# Altium schematic sheet NMT_VGA.SCHDOC
size A4; Organization: Altium Limited; Address1: L3, 12a Rodborough Rd; Address2: Frenchs Forest; Address3: NSW; Address4: Australia 2086; DocumentNumber: 4; SheetNumber: 10; SheetTotal: 13
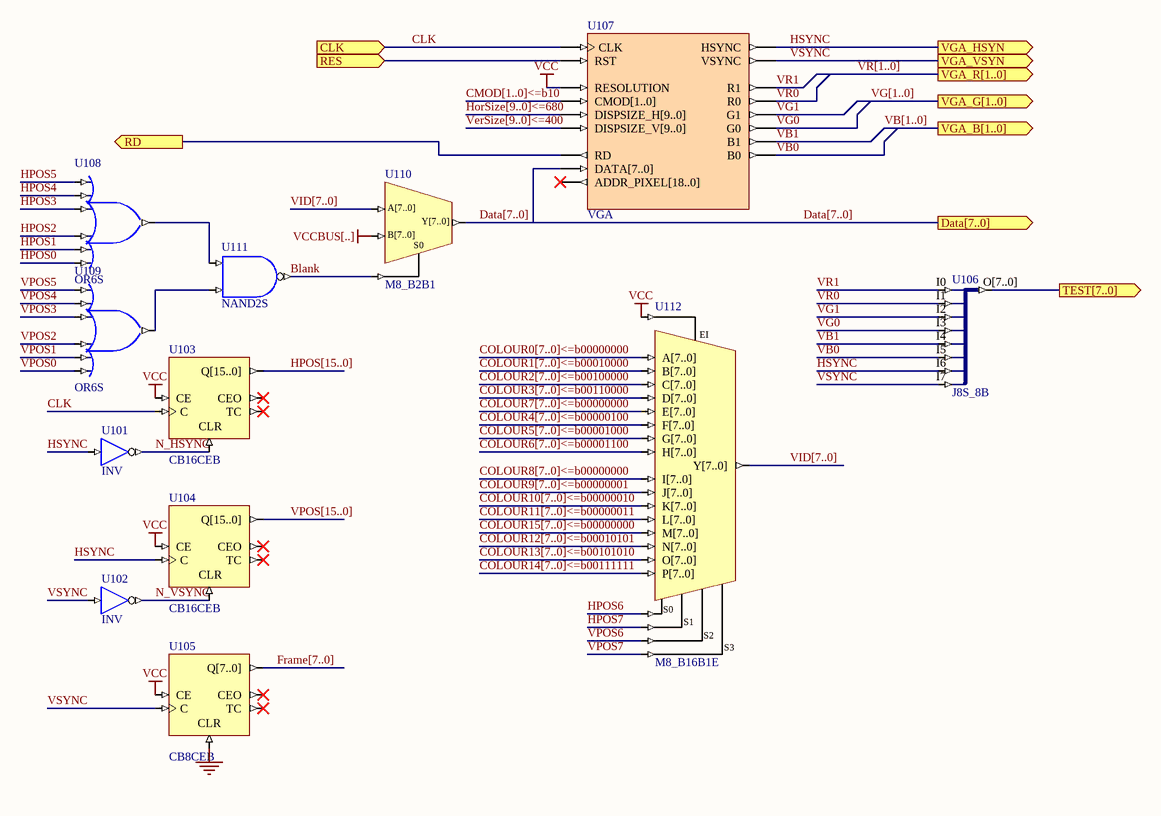
[diagram p0: NMT_VGA.SCHDOC]

## Parts
U101  INV
U102  INV
U103  CB16CEB
U104  CB16CEB
U105  CB8CEB
U106  J8S_8B
U107  VGA
U108  OR6S
U109  OR6S
U110  M8_B2B1
U111  NAND2S
U112  M8_B16B1E

## Ports
CLK (in), Data[7..0] (out), RD (out), RES (in), TEST[7..0] (out), VGA_B[1..0] (out), VGA_G[1..0] (out), VGA_HSYN (out), VGA_R[1..0] (out), VGA_VSYN (out)

## Nets
GND: U105.CLR
VCC: U103.CE U104.CE U105.CE U107.RESOLUTION U112.EI
VCCBUS[..]: U110.B[7..0]
Blank: U110.S0 U111.O
CLK: U103.C U107.CLK ; port CLK
CMOD[1..0]<=b10: U107.CMOD[1..0]
COLOUR0[7..0]<=b00000000: U112.A[7..0]
COLOUR1[7..0]<=b00010000: U112.B[7..0]
COLOUR2[7..0]<=b00100000: U112.C[7..0]
COLOUR3[7..0]<=b00110000: U112.D[7..0]
COLOUR4[7..0]<=b00000100: U112.F[7..0]
COLOUR5[7..0]<=b00001000: U112.G[7..0]
COLOUR6[7..0]<=b00001100: U112.H[7..0]
COLOUR7[7..0]<=b00000000: U112.E[7..0]
COLOUR8[7..0]<=b00000000: U112.I[7..0]
COLOUR9[7..0]<=b00000001: U112.J[7..0]
COLOUR10[7..0]<=b00000010: U112.K[7..0]
COLOUR11[7..0]<=b00000011: U112.L[7..0]
COLOUR12[7..0]<=b00010101: U112.N[7..0]
COLOUR13[7..0]<=b00101010: U112.O[7..0]
COLOUR14[7..0]<=b00111111: U112.P[7..0]
COLOUR15[7..0]<=b00000000: U112.M[7..0]
Data[7..0]: U107.DATA[7..0] U110.Y[7..0] ; port Data[7..0]
Frame[7..0]: U105.Q[7..0]
HorSize[9..0]<=680: U107.DISPSIZE_H[9..0]
HPOS0: U108.I5
HPOS1: U108.I4
HPOS2: U108.I3
HPOS3: U108.I2
HPOS4: U108.I1
HPOS5: U108.I0
HPOS6: U112.S0
HPOS7: U112.S1
HPOS[15..0]: U103.Q[15..0]
HSYNC: U101.I U104.C U106.I6 U107.HSYNC ; port VGA_HSYN
N_HSYNC: U101.O U103.CLR
N_VSYNC: U102.O U104.CLR
RD: U107.RD ; port RD
RES: U107.RST ; port RES
TEST[7..0]: U106.O[7..0] ; port TEST[7..0]
VB0: U106.I5 U107.B0
VB1: U106.I4 U107.B1
VerSize[9..0]<=400: U107.DISPSIZE_V[9..0]
VG0: U106.I3 U107.G0
VG1: U106.I2 U107.G1
VID[7..0]: U110.A[7..0] U112.Y[7..0]
VPOS0: U109.I5
VPOS1: U109.I4
VPOS2: U109.I3
VPOS3: U109.I2
VPOS4: U109.I1
VPOS5: U109.I0
VPOS6: U112.S2
VPOS7: U112.S3
VPOS[15..0]: U104.Q[15..0]
VR0: U106.I1 U107.R0
VR1: U106.I0 U107.R1
VSYNC: U102.I U105.C U106.I7 U107.VSYNC ; port VGA_VSYN
NetU108_O: U108.O U111.I0
NetU109_O: U109.O U111.I1

Not connected (* = marked no-connect by the designer): U103 CEO* TC*; U104 CEO* TC*; U105 CEO* TC*; U107 ADDR_PIXEL[18..0]*

## Buses and harness runs
bus CMOD[1..0]<=b10
bus COLOUR0[7..0]<=b00000000
bus COLOUR1[7..0]<=b00010000
bus COLOUR2[7..0]<=b00100000
bus COLOUR3[7..0]<=b00110000
bus COLOUR4[7..0]<=b00000100
bus COLOUR5[7..0]<=b00001000
bus COLOUR6[7..0]<=b00001100
bus COLOUR7[7..0]<=b00000000
bus COLOUR8[7..0]<=b00000000
bus COLOUR9[7..0]<=b00000001
bus COLOUR10[7..0]<=b00000010
bus COLOUR11[7..0]<=b00000011
bus COLOUR12[7..0]<=b00010101
bus COLOUR13[7..0]<=b00101010
bus COLOUR14[7..0]<=b00111111
bus COLOUR15[7..0]<=b00000000
bus Data[7..0] = port Data[7..0]
bus Frame[7..0]
bus HorSize[9..0]<=680
bus HPOS[15..0]
bus VB[1..0] = port VGA_B[1..0]
bus VerSize[9..0]<=400
bus VG[1..0] = port VGA_G[1..0]
bus VID[7..0]
bus VPOS[15..0]
bus VR[1..0] = port VGA_R[1..0]

## Notes on the sheet
- Title
- Size:
- Date:
- A4
- Number:
- Time:
- Revision:
- Sheet
- of
- File:

## Library data of the parts
U101 U102 = INV: Inverter; ArchiveName: GENERIC; Published: 4-Dec-2003; Publisher: Altium Limited; Xilinx Equivalent: INV; Core Revision: 1.00.00
U103 U104 = CB16CEB: 16-Bit Cascadable Binary Counters with Clock Enable and Asynchronous Clear, Bus Version; Xilinx Equivalent: CB16CE; ArchiveName: GENERIC; Published: 4-Dec-2003; Publisher: Altium Limited; Core Revision: 1.00.00
U105 = CB8CEB: 8-Bit Cascadable Binary Counters with Clock Enable and Asynchronous Clear, Bus Version; Xilinx Equivalent: CB8CE; ArchiveName: GENERIC; Published: 4-Dec-2003; Publisher: Altium Limited; Core Revision: 1.00.00
U106 = J8S_8B: 8 Single pin inputs to single 8-Bit output bus; ArchiveName: GENERIC; Published: 4-Dec-2003; Publisher: Altium Limited; Core Revision: 1.00.00
U107 = VGA: VGA Controller; Published: 21/10/2003; Publisher: Altium Hobart Technology Centre; Core Revision: 1.00.00
U108 U109 = OR6S: 6-Input OR Gate, Single Pin Version; Xilinx Equivalent: OR6; ArchiveName: GENERIC; Published: 4-Dec-2003; Publisher: Altium Limited; Core Revision: 1.00.00
U110 = M8_B2B1: 2x8-Bit Bus to 1x8-Bit Bus Multiplexer; ArchiveName: GENERIC; Published: 4-Dec-2003; Publisher: Altium Limited; Core Revision: 1.00.00
U111 = NAND2S: 2-Input NAND Gate, Single Pin Version; Xilinx Equivalent: NAND2; ArchiveName: GENERIC; Published: 4-Dec-2003; Publisher: Altium Limited; Core Revision: 1.00.00
U112 = M8_B16B1E: 16x8-Bit Bus to 1x8-Bit Bus Multiplexer With Enable; ArchiveName: GENERIC; Published: 18-Dec-2003; Publisher: Altium Limited; Core Revision: 1.00.00